# EAGLE design ddrive-esp-deadrail-1-8-routed (EAGLE 7.5.0)
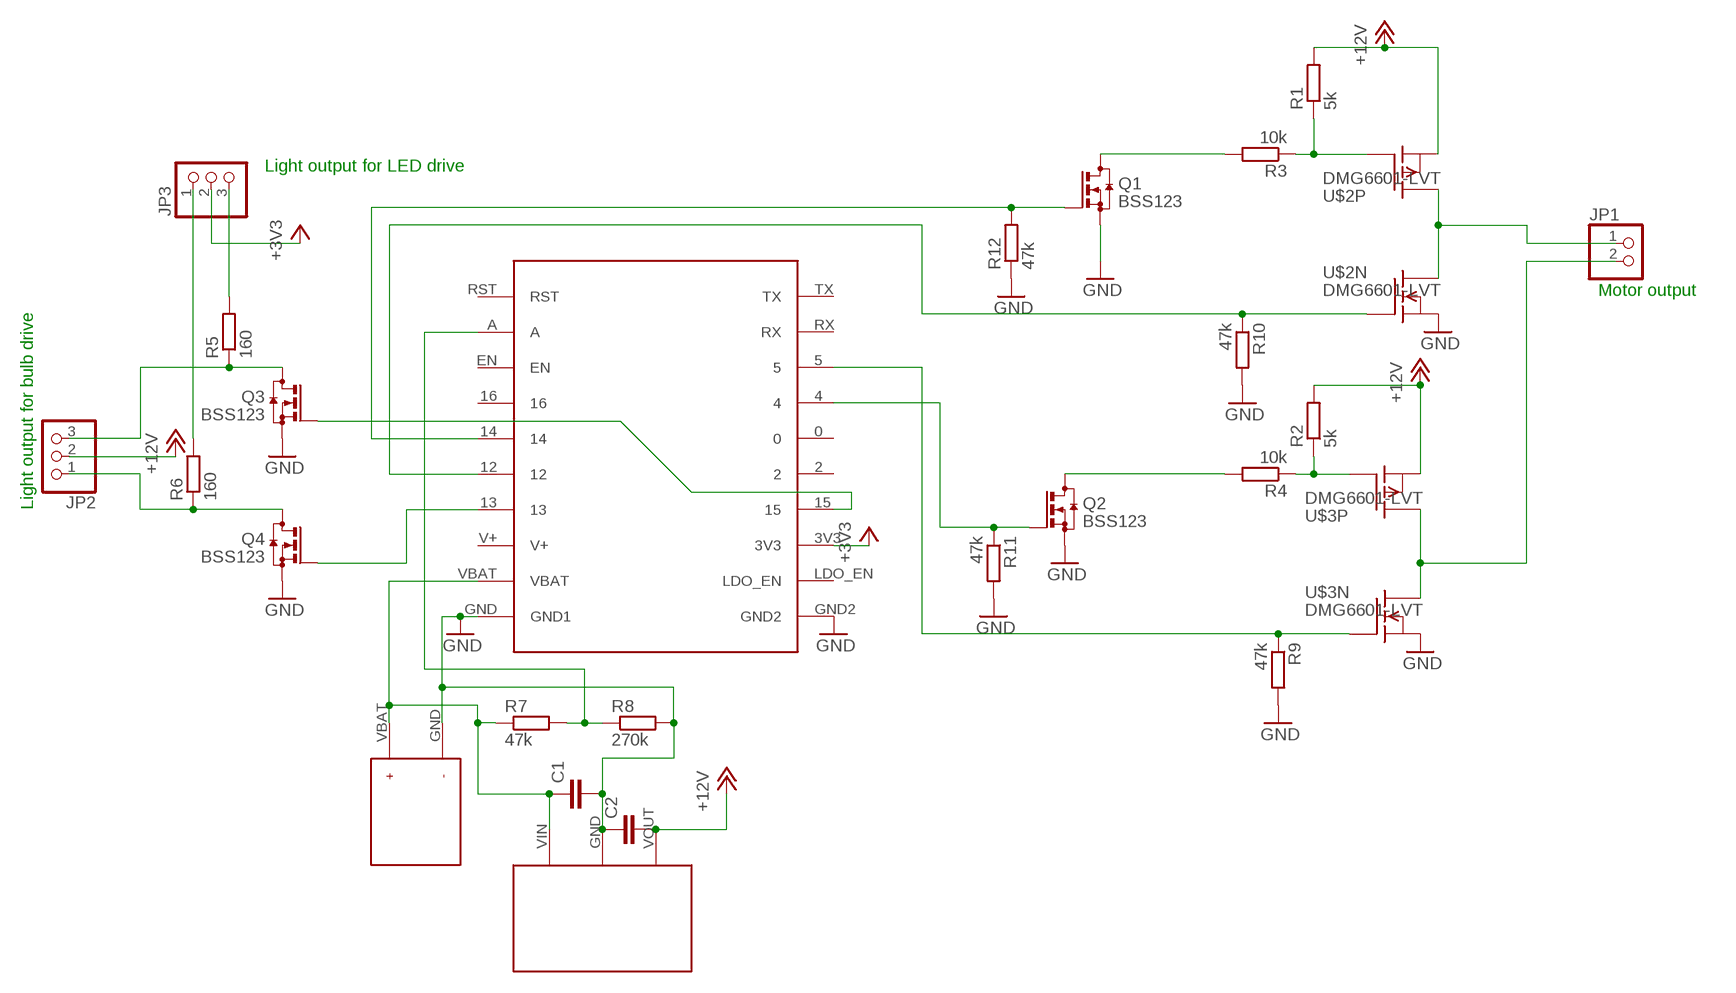
[diagram p0: schematic, sheet 1]

## Parts
C1  C-EUC1210  [C1210]
C2  C-EUC1210  [C1210]
JP1  PINHD-1X2  [1X02]
JP2  PINHD-1X3  [1X03]
JP3  PINHD-1X3  [1X03]
Q1  BSS123  [SOT23]
Q2  BSS123  [SOT23]
Q3  BSS123  [SOT23]
Q4  BSS123  [SOT23]
R1  5k  R-EU_R0805  [R0805]
R2  5k  R-EU_R0805  [R0805]
R3  10k  R-EU_R0805  [R0805]
R4  10k  R-EU_R0805  [R0805]
R5  160  R-EU_R0805  [R0805]
R6  160  R-EU_R0805  [R0805]
R7  47k  R-EU_R0805  [R0805]
R8  270k  R-EU_R0805  [R0805]
R9  47k  R-EU_R0805  [R0805]
R10  47k  R-EU_R0805  [R0805]
R11  47k  R-EU_R0805  [R0805]
R12  47k  R-EU_R0805  [R0805]
U$1  ESP12-HUZZAH  [ESP12-HUZZAH]
U$2  DMG6601-LVT  [TSOT-26]
U$3  DMG6601-LVT  [TSOT-26]
U$4  JST-PINHD  [JST-PINHDR]
U$5  POLOLU-VREG12  [POLOLU-REGULATOR]

## Nets
+3V3: JP3.2 U$1.3V3
+12V: C2.2 JP2.2 R1.2 R2.2 U$2.2(P:S) U$3.2(P:S) U$5.VOUT
GND: C1.2 C2.1 Q1.2(S) Q2.2(S) Q3.2(S) Q4.2(S) R8.2 R9.2 R10.2 R11.2 R12.1 U$1.GND2 U$1.GND(GND1) U$2.5(N:S) U$3.5(N:S) U$4.GND U$5.GND
N$1: JP1.1 U$2.4(P:D) U$2.6(N:D)
N$2: R1.1 R3.1 U$2.3(P:G)
N$3: Q2.3(D) R4.2
N$4: R2.1 R4.1 U$3.3(P:G)
N$5: Q1.1(G) R12.2 U$1.14
N$6: Q1.3(D) R3.2
N$7: JP1.2 U$3.4(P:D) U$3.6(N:D)
N$8: R10.1 U$1.12 U$2.1(N:G)
N$9: Q2.1(G) R11.1 U$1.4
N$10: R9.1 U$1.5 U$3.1(N:G)
N$11: Q3.1(G) U$1.15
N$12: Q4.1(G) U$1.13
N$13: JP2.3 Q3.3(D) R5.1
N$14: JP2.1 Q4.3(D) R6.1
N$15: JP3.3 R5.2
N$16: JP3.1 R6.2
N$19: R7.2 R8.1 U$1.A
VBAT: C1.1 R7.1 U$1.VBAT U$4.VBAT U$5.VIN
Unconnected: U$1.0 U$1.2 U$1.16 U$1.EN U$1.LDO_EN U$1.RST U$1.RX U$1.TX

## Notes on the sheet
- Light output for LED drive
- Motor output
- Light output for bulb drive

## Power pins joined to a net without a drawn wire
V+: U$1.V+

## Library data of the parts
C1 C2 = rcl:C-EU: CAPACITOR, European symbol
JP1 = pinhead:PINHD-1X2: PIN HEADER
JP2 JP3 = pinhead:PINHD-1X3: PIN HEADER
Q1-Q4 = transistor-small-signal:BSS123: N-CHANNEL MOS FET
R1-R12 = rcl:R-EU_: RESISTOR, European symbol
U$1 = trainlib:ESP12-HUZZAH
U$2 U$3 = trainlib:DMG6601-LVT: Dual N+P-channel MOSFET. Package: TSOT-26 Vmax=30V N-channel: 55mOhm, 3.8A Imax P-channel: 110mOhm, 2.5A Imax
U$4 = trainlib:JST-PINHD
U$5 = trainlib:POLOLU-VREG12

## Board
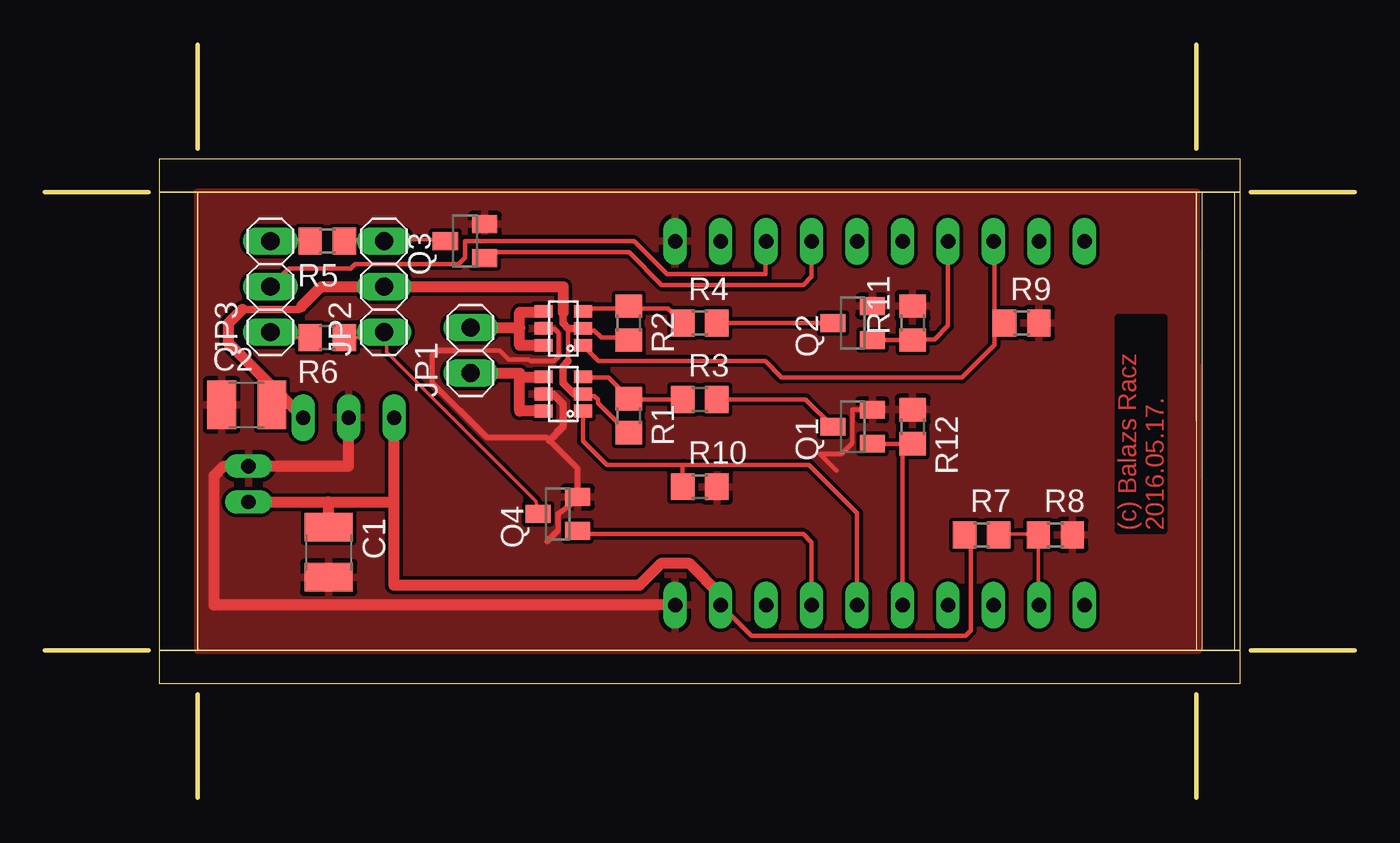
[diagram p1: board, top side]
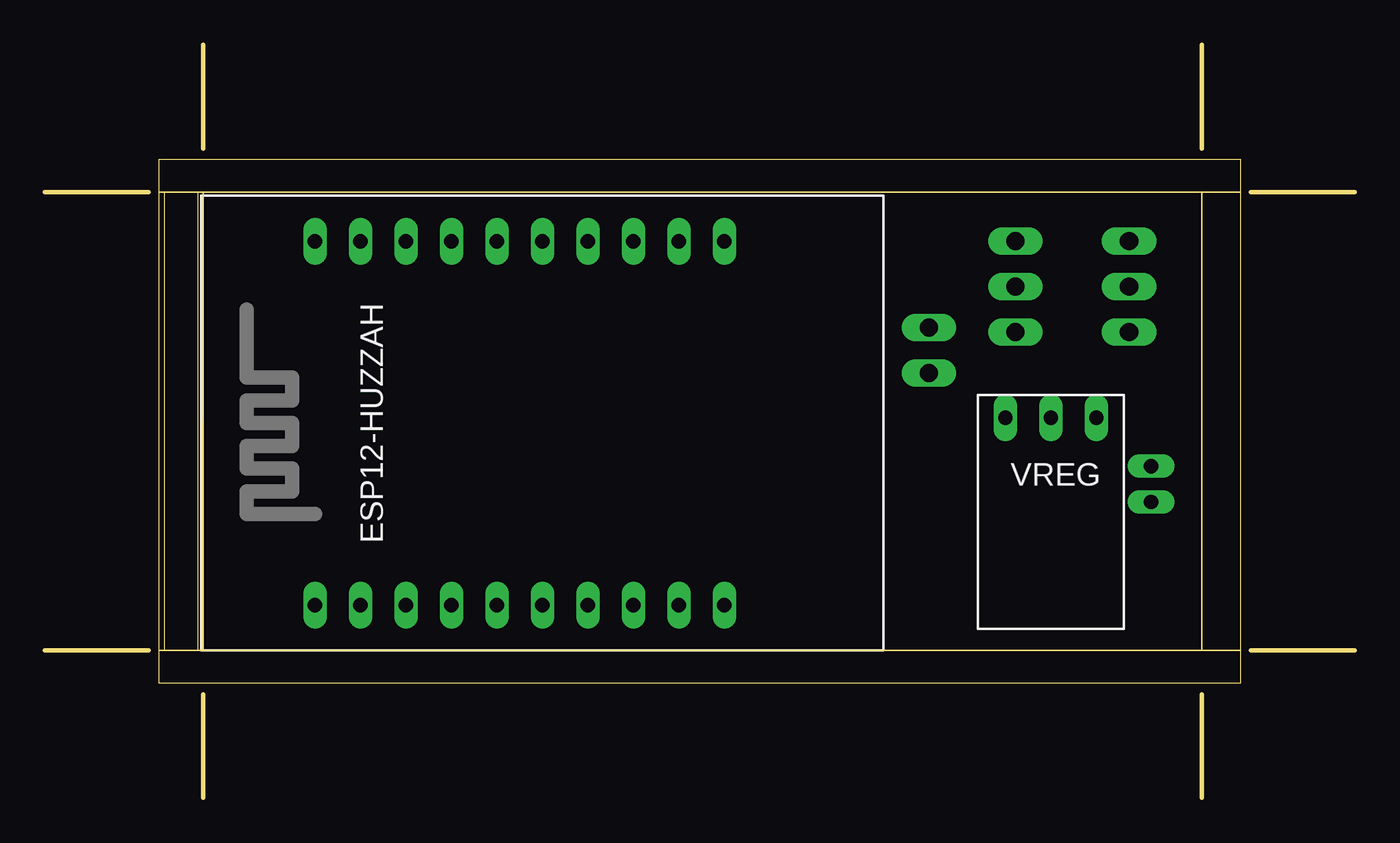
[diagram p2: board, bottom side, seen from below]

Size 73.15 x 42.06 mm. Coordinates in mm from the lower left corner, seen from the top.
Outline: 5.79,33.83 0,33.83
Outline: 8.53,42.06 8.53,36.27
Outline: 64.31,42.06 64.31,36.27
Outline: 67.36,33.83 73.15,33.83
Outline: 67.36,8.23 73.15,8.23
Outline: 64.31,0 64.31,5.79
Outline: 8.53,0 8.53,5.79
Outline: 5.79,8.23 0,8.23
Outline: 8.53,8.23 64.34,8.23 64.31,33.83 8.53,33.83 8.53,8.23
Copper layers (1*16): Top 0.035mm / dielectric 1.5mm / Bottom 0.035mm
Design rules "self-etch": minimum track width 8mil, minimum drill 24mil, track to track 8mil, track to pad 8mil, pad to pad 8mil, via to via 8mil, smd to smd 0mil, copper to edge 0mil, drill to drill 8mil, minimum pad ring 10mil, minimum via ring 8mil, stop-mask expansion 4mil, vias tented up to drill 0mil, thermal gap 10mil

### Footprints (pad centres in the part's own frame; a part is rotated, then mirrored left to right if it is on the bottom)
C1210 = smd 1.6 x 2.7: 1 -1.4,0; 2 1.4,0
1X02 = drill 1.016 long: 1 -1.27,0; 2 1.27,0
1X03 = drill 1.016 long: 1 -2.54,0; 2 0,0; 3 2.54,0
SOT23 = smd 1 x 1.4: 1 -0.95,-1.1; 2 0.95,-1.1; 3 0,1.1
R0805 = smd 1.3 x 1.5: 1 -0.95,0; 2 0.95,0
ESP12-HUZZAH = drill 0.8 long: 0 10.16,2.54; 2 10.16,0; 3V3 10.16,-5.08; 4 10.16,5.08; 5 10.16,7.62; 12 -10.16,0; 13 -10.16,-2.54; 14 -10.16,2.54; 15 10.16,-2.54; 16 -10.16,5.08; A -10.16,10.16; EN -10.16,7.62; GND -10.16,-10.16; GND2 10.16,-10.16; LDO_EN 10.16,-7.62; RST -10.16,12.7; RX 10.16,10.16; TX 10.16,12.7; V+ -10.16,-5.08; VBAT -10.16,-7.62
TSOT-26 = smd 0.7 x 1: 1 -0.95,-1.1; 2 0,-1.1; 3 0.95,-1.1; 4 0.95,1.1; 5 0,1.1; 6 -0.95,1.1
JST-PINHDR = drill 0.8 long: GND -1,0; VBAT 1,0
POLOLU-REGULATOR = drill 0.8 long: GND 4.064,1.27; VIN 6.604,1.27; VOUT 1.524,1.27

### Placement (x,y rotation side)
C1  15.85,13.72 270 top
C2  11.28,21.95 0 top
JP1  23.77,24.99 90 top
JP2  18.95,28.55 90 top
JP3  12.6,28.55 90 top
Q1  45.11,20.73 90 top
Q2  45.11,26.52 90 top
Q3  23.47,31.09 90 top
Q4  28.65,15.85 90 top
R1  32.61,21.34 270 top
R2  32.61,26.52 270 top
R3  36.58,22.25 0 top
R4  36.58,26.52 0 top
R5  15.77,31.09 180 top
R6  15.77,25.7 180 top
R7  52.32,14.68 0 top
R8  56.44,14.68 0 top
R9  54.56,26.52 0 top
R10  36.58,17.37 0 top
R11  48.46,26.52 90 top
R12  48.46,20.73 270 top
U$1  45.36,20.93 90 bottom
U$2  28.96,22.56 90 top
U$3  28.96,26.21 90 top
U$4  11.38,17.53 270 top
U$5  12.9,22.5 180 bottom

### Tracks (layer width: path | path; a pad name or v marks a point on that pad's centre or on a via)
+3V3
  Top 0.254: U$1.3V3 40.23,31.04 40.23,29.26 34.75,29.26 32.92,31.09 23.47,31.09 23.47,30.18 23.11,29.82 17.32,29.82 17.07,29.57 13.61,29.57 JP3.2
+12V
  Top 0.203: 32.51,20.42 R1.2 | 30.07,22.45 U$2.2 | 32.51,25.7 R2.2 | 30.07,26.11 U$3.2
  Top 0.254: 29.21,26.21 29.21,24.38 | 29.57,22.56 U$2.2 | 32.51,20.42 30.89,22.05 30.89,22.25 30.68,22.45 30.07,22.45 | 32.51,25.7 31.09,25.7 30.68,26.11 30.07,26.11
  Top 0.406: 28.96,27.13 28.96,26.52 29.21,26.21 U$3.2 | 29.21,24.38 28.96,24.08 28.96,23.16 29.57,22.56 | 11.02,27.28 14.17,27.28 14.33,27.43
  Top 0.61: 28.96,27.13 28.96,28.55 JP2.2 15.44,28.55 14.33,27.43 | 13.41,22.25 10.26,25.4 10.26,26.52 11.02,27.28 | 13.41,22.25 U$5.VOUT | C2.2 12.68,22.25 13.41,22.25
GND
  Top 0.254: U$3.5 28.45,26.21 28.7,25.96 28.7,24.64 28.45,24.38 27.13,24.38 27.03,24.49 25.91,24.49 25.4,24.99 22.86,24.99 | Q1.2 45.11,21.68 45.11,19.81 44.5,19.2 43.28,19.2 44.2,18.29
  Top 0.305: 22.86,24.99 21.95,24.99 21.64,24.69 21.64,23.16 24.69,20.12 28.04,20.12 28.19,19.96 29.75,18.41 Q4.2 29.92,16.76 | 29.92,16.76 29.87,16.76 | 29.92,16.76 28.65,15.85 28.65,14.94 28.04,14.33
  Top 0.406: U$2.5 28.4,22.56 28.96,22 28.96,20.73 28.19,19.96
  Top 0.61: U$5.GND 16.97,18.53 U$4.GND 9.99,18.53 9.45,17.98 9.45,10.77 U$1.GND
  pour Top: 8.53,33.83 64.31,33.83 64.41,8.23 8.53,8.23
N$1
  Top 0.61: U$2.6 26.52,21.61 26.52,23.51 | 26.52,23.51 U$2.4 | JP1.1 26.52,23.72 26.52,23.51
N$2
  Top 0.203: 30.07,23.47 U$2.3 | 32.51,22.45 R1.1 32.72,22.25
  Top 0.254: 30.07,23.47 31.5,23.47 32.51,22.45 | 32.72,22.25 R3.1
N$3
  Top 0.203: 37.59,26.52 R4.2
  Top 0.254: Q2.3 R4.2
N$4
  Top 0.203: 30.07,27.33 U$3.3 | 32.51,27.33 R2.1 32.72,27.33
  Top 0.254: 32.51,27.33 30.07,27.33 | R4.1 34.8,27.33 32.72,27.33
N$5
  Top 0.254: U$1.14 47.9,19.22 R12.2 Q1.1
N$6
  Top 0.254: R3.2 42.49,22.25 Q1.3
N$7
  Top 0.61: U$3.6 26.52,25.26 26.52,26.26 | 26.52,26.26 26.52,27.13 27.86,27.13 U$3.4 | JP1.2 26.52,26.26
N$8
  Top 0.254: U$2.1 30.06,19.93 31.39,18.59 35.66,18.59 | 35.66,18.59 42.67,18.59 45.36,15.9 U$1.12 | R10.1 35.63,18.56 35.66,18.59
N$9
  Top 0.254: U$1.4 50.44,26.37 49.68,25.6 48.5,25.6 R11.1 Q2.1
N$10
  Top 0.254: U$3.1 30.93,24.38 40.23,24.38 41.15,23.47 51.21,23.47 53.04,25.3 53.04,26.52 | 53.04,26.52 53.04,31.04 U$1.5 | R9.1 53.04,26.52
N$11
  Top 0.254: U$1.15 42.82,29.11 42.37,28.65 34.44,28.65 32.61,30.48 24.91,30.48 Q3.1
N$12
  Top 0.203: 29.87,14.73 Q4.1
  Top 0.254: 29.87,14.73 42.37,14.73 42.82,14.27 U$1.13
N$13
  Top 0.203: Q3.3 22.35,31.19 19.1,31.19 JP2.3 18.9,31.19 16.87,31.19 R5.1
N$14
  Top 0.203: 19.1,25.7 19.1,25.91 JP2.1 19.1,25.7 | 19.1,25.7 19.1,24.89 27.43,16.56 Q4.3 | 19.1,25.7 R6.1
N$15
  Top 0.203: R5.2 14.63,31.19 12.6,31.19 JP3.3
N$16
  Top 0.203: R6.2 12.8,25.7 12.6,25.91 JP3.1
N$19
  Top 0.203: R7.2 53.44,14.73 55.47,14.73 R8.1 55.47,14.53 55.47,10.87 U$1.A
VBAT
  Top 0.254: U$1.VBAT 39.47,9.04 51.41,9.04 51.71,9.35 51.71,14.63 R7.1
  Top 0.61: U$1.VBAT 37.74,11.33 35.97,13.11 34.44,13.11 33.22,11.89 19.51,11.89 19.51,16.53 | U$4.VBAT 15.85,16.53 | 15.85,16.53 19.51,16.53 | 19.51,16.53 U$5.VIN | C1.1 15.85,16.53

### Text on the board
Top: (c) Balazs Racz / 2016.05.17.